# Altium schematic sheet cSLIM-SA.SchDoc: cSLIM v1 - Overview
size A4; Date: 11.01.2022; Author: Vetle Berg Abrahamsen; DrawnBy: Vetle Berg Abrahamsen; Revision: v1; SheetNumber: 1; SheetTotal: 12; PathAndName: C:\User\..\cSLIM-SA.SchDoc; Size: A4
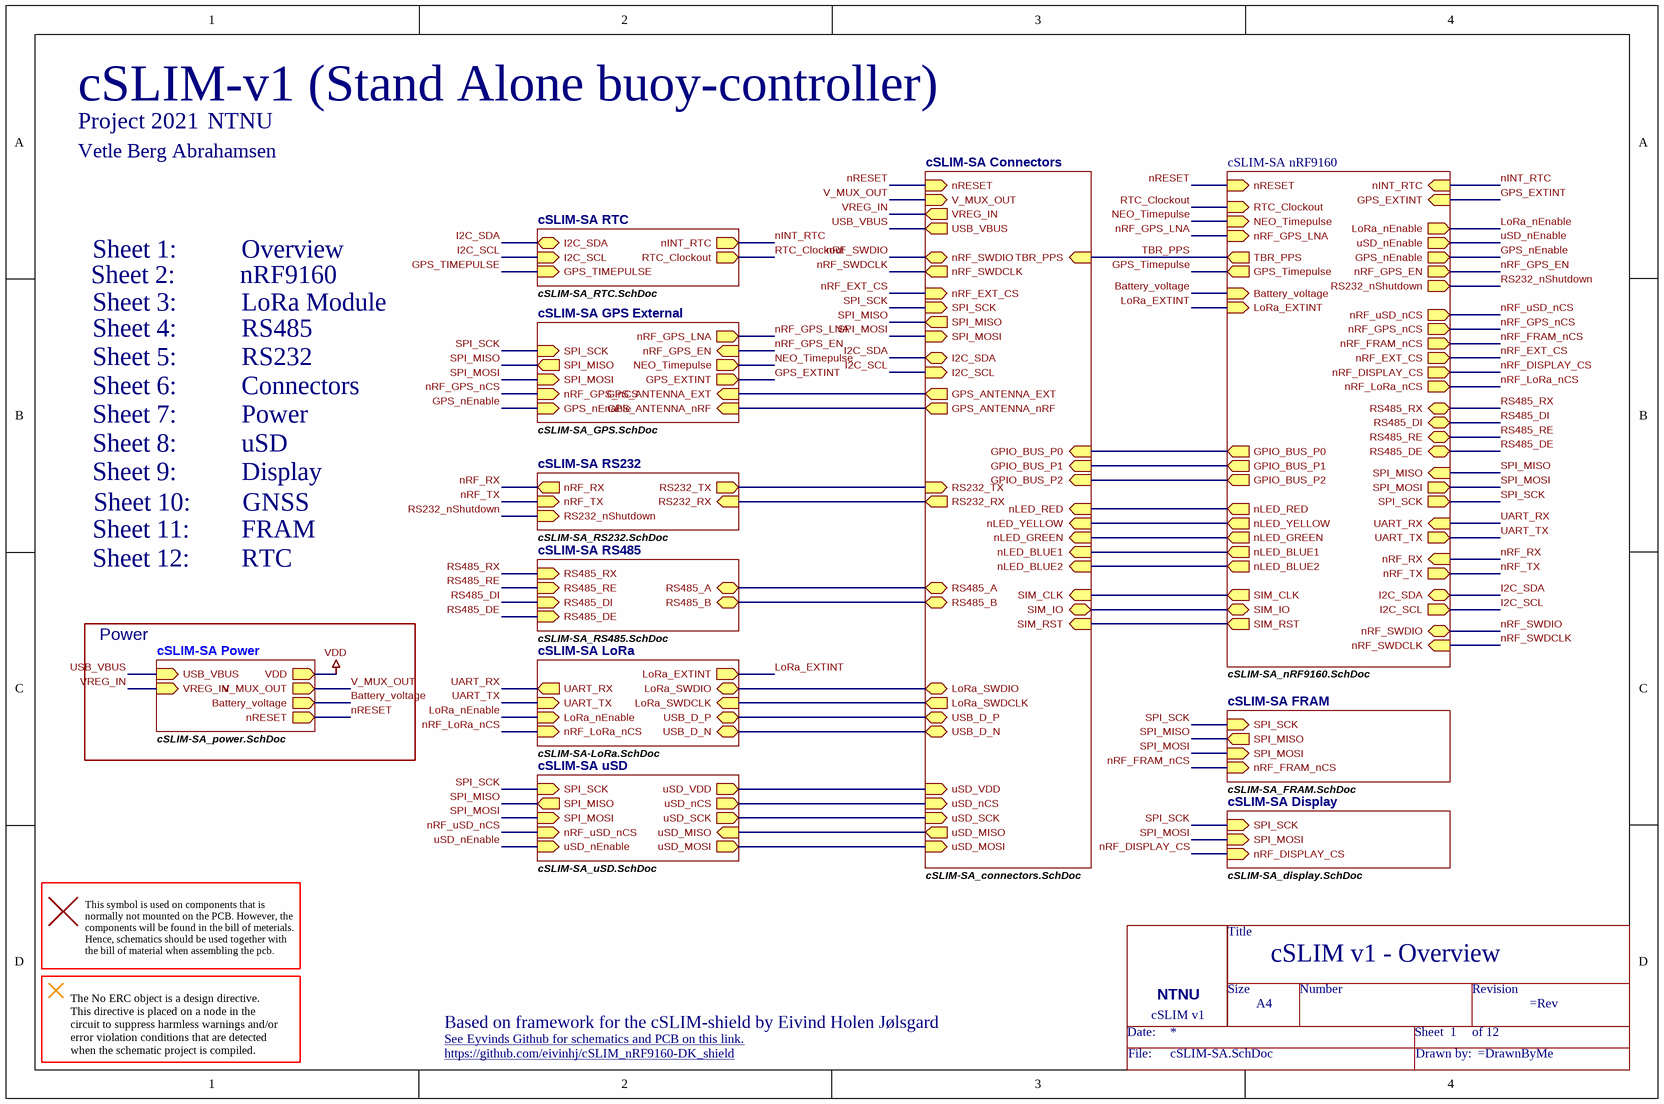
[diagram p0: cSLIM-SA.SchDoc]

## Parts
=DocumentName  Title_block  (value not drawn)  (no BOM)

## Sub-sheets
cSLIM-SA Connectors = cSLIM-SA_connectors.SchDoc: RS485_A (bidir), RS485_B (bidir), TBR_PPS (in), V_MUX_OUT (in), RS232_TX (in), RS232_RX (out), LoRa_SWDIO (bidir), LoRa_SWDCLK (out), nRESET (in), USB_D_N (bidir), USB_D_P (bidir), USB_VBUS (out), uSD_nCS (in), uSD_MOSI (in), uSD_SCK (in), uSD_MISO (out), uSD_VDD (in), nRF_EXT_CS (in), SPI_SCK (in), SPI_MOSI (in), SPI_MISO (out), I2C_SCL (in), I2C_SDA (bidir), nLED_RED (in), nLED_YELLOW (in), nLED_GREEN (in), nLED_BLUE1 (in), GPS_ANTENNA_EXT (out), nLED_BLUE2 (in), nRF_SWDIO (bidir), nRF_SWDCLK (out), SIM_CLK (in), SIM_RST (in), SIM_IO (bidir), GPS_ANTENNA_nRF (out), VREG_IN (out), GPIO_BUS_P0 (in), GPIO_BUS_P1 (in), GPIO_BUS_P2 (in)
cSLIM-SA Display = cSLIM-SA_display.SchDoc: SPI_SCK (in), SPI_MOSI (in), nRF_DISPLAY_CS (in)
cSLIM-SA FRAM = cSLIM-SA_FRAM.SchDoc: SPI_MISO (out), nRF_FRAM_nCS (in), SPI_SCK (in), SPI_MOSI (in)
cSLIM-SA GPS External = cSLIM-SA_GPS.SchDoc: nRF_GPS_nCS (in), GPS_nEnable (in), SPI_MISO (out), SPI_MOSI (in), SPI_SCK (in), NEO_Timepulse (out), GPS_EXTINT (out), GPS_ANTENNA_EXT (in), nRF_GPS_EN (in), GPS_ANTENNA_nRF (in), nRF_GPS_LNA (out)
cSLIM-SA LoRa = cSLIM-SA-LoRa.SchDoc: UART_RX (out), UART_TX (in), USB_D_P (bidir), USB_D_N (bidir), LoRa_SWDIO (bidir), LoRa_SWDCLK (in), LoRa_nEnable (in), LoRa_EXTINT (out), nRF_LoRa_nCS (in)
cSLIM-SA nRF9160 = cSLIM-SA_nRF9160.SchDoc: nRESET (in), RS485_RX (bidir), RS485_DI (bidir), nLED_RED (out), nINT_RTC (in), nLED_GREEN (out), LoRa_nEnable (out), uSD_nEnable (out), nRF_uSD_nCS (out), UART_RX (in), UART_TX (out), nRF_GPS_nCS (out), RS232_nShutdown (out), GPS_nEnable (out), Battery_voltage (in), nRF_EXT_CS (out), I2C_SDA (bidir), I2C_SCL (out), RS485_RE (bidir), RS485_DE (bidir), TBR_PPS (out), SPI_MISO (in), SPI_MOSI (out), SPI_SCK (out), LoRa_EXTINT (in), nRF_RX (in), nRF_TX (out), nRF_FRAM_nCS (out), RTC_Clockout (in), GPS_Timepulse (out), nRF_SWDIO (bidir), nRF_SWDCLK (in), SIM_CLK (out), SIM_IO (bidir), SIM_RST (out), nRF_DISPLAY_CS (out), nLED_YELLOW (out), nLED_BLUE1 (out), nLED_BLUE2 (out), GPS_EXTINT (in), nRF_GPS_EN (out), nRF_GPS_LNA (in), NEO_Timepulse (in), GPIO_BUS_P0 (out), GPIO_BUS_P2 (out), GPIO_BUS_P1 (out), nRF_LoRa_nCS (out)
cSLIM-SA Power = cSLIM-SA_power.SchDoc: nRESET (out), VDD (out), USB_VBUS (in), V_MUX_OUT (out), Battery_voltage (out), VREG_IN (in)
cSLIM-SA RS232 = cSLIM-SA_RS232.SchDoc: RS232_nShutdown (in), RS232_TX (out), RS232_RX (in), nRF_TX (in), nRF_RX (out)
cSLIM-SA RS485 = cSLIM-SA_RS485.SchDoc: RS485_RX (in), RS485_RE (in), RS485_DE (in), RS485_DI (in), RS485_B (bidir), RS485_A (bidir)
cSLIM-SA RTC = cSLIM-SA_RTC.SchDoc: I2C_SCL (in), I2C_SDA (bidir), nINT_RTC (out), RTC_Clockout (out), GPS_TIMEPULSE (in)
cSLIM-SA uSD = cSLIM-SA_uSD.SchDoc: uSD_VDD (out), uSD_MISO (in), uSD_MOSI (out), uSD_SCK (out), uSD_nCS (out), nRF_uSD_nCS (in), uSD_nEnable (in), SPI_MISO (out), SPI_MOSI (in), SPI_SCK (in)

## Nets
VDD: sheet cSLIM-SA Power/VDD
Battery_voltage: sheet cSLIM-SA Power/Battery_voltage, sheet cSLIM-SA nRF9160/Battery_voltage
GPS_EXTINT: sheet cSLIM-SA GPS External/GPS_EXTINT, sheet cSLIM-SA nRF9160/GPS_EXTINT
GPS_nEnable: sheet cSLIM-SA GPS External/GPS_nEnable, sheet cSLIM-SA nRF9160/GPS_nEnable
GPS_TIMEPULSE: sheet cSLIM-SA RTC/GPS_TIMEPULSE, sheet cSLIM-SA nRF9160/GPS_Timepulse
I2C_SCL: sheet cSLIM-SA Connectors/I2C_SCL, sheet cSLIM-SA RTC/I2C_SCL, sheet cSLIM-SA nRF9160/I2C_SCL
I2C_SDA: sheet cSLIM-SA Connectors/I2C_SDA, sheet cSLIM-SA RTC/I2C_SDA, sheet cSLIM-SA nRF9160/I2C_SDA
LoRa_EXTINT: sheet cSLIM-SA LoRa/LoRa_EXTINT, sheet cSLIM-SA nRF9160/LoRa_EXTINT
LoRa_nEnable: sheet cSLIM-SA LoRa/LoRa_nEnable, sheet cSLIM-SA nRF9160/LoRa_nEnable
NEO_Timepulse: sheet cSLIM-SA GPS External/NEO_Timepulse, sheet cSLIM-SA nRF9160/NEO_Timepulse
nINT_RTC: sheet cSLIM-SA RTC/nINT_RTC, sheet cSLIM-SA nRF9160/nINT_RTC
nRESET: sheet cSLIM-SA Connectors/nRESET, sheet cSLIM-SA Power/nRESET, sheet cSLIM-SA nRF9160/nRESET
nRF_DISPLAY_CS: sheet cSLIM-SA Display/nRF_DISPLAY_CS, sheet cSLIM-SA nRF9160/nRF_DISPLAY_CS
nRF_EXT_CS: sheet cSLIM-SA Connectors/nRF_EXT_CS, sheet cSLIM-SA nRF9160/nRF_EXT_CS
nRF_FRAM_nCS: sheet cSLIM-SA FRAM/nRF_FRAM_nCS, sheet cSLIM-SA nRF9160/nRF_FRAM_nCS
nRF_GPS_EN: sheet cSLIM-SA GPS External/nRF_GPS_EN, sheet cSLIM-SA nRF9160/nRF_GPS_EN
nRF_GPS_LNA: sheet cSLIM-SA GPS External/nRF_GPS_LNA, sheet cSLIM-SA nRF9160/nRF_GPS_LNA
nRF_GPS_nCS: sheet cSLIM-SA GPS External/nRF_GPS_nCS, sheet cSLIM-SA nRF9160/nRF_GPS_nCS
nRF_LoRa_nCS: sheet cSLIM-SA LoRa/nRF_LoRa_nCS, sheet cSLIM-SA nRF9160/nRF_LoRa_nCS
nRF_RX: sheet cSLIM-SA RS232/nRF_RX, sheet cSLIM-SA nRF9160/nRF_RX
nRF_SWDCLK: sheet cSLIM-SA Connectors/nRF_SWDCLK, sheet cSLIM-SA nRF9160/nRF_SWDCLK
nRF_SWDIO: sheet cSLIM-SA Connectors/nRF_SWDIO, sheet cSLIM-SA nRF9160/nRF_SWDIO
nRF_TX: sheet cSLIM-SA RS232/nRF_TX, sheet cSLIM-SA nRF9160/nRF_TX
nRF_uSD_nCS: sheet cSLIM-SA uSD/nRF_uSD_nCS, sheet cSLIM-SA nRF9160/nRF_uSD_nCS
RS232_nShutdown: sheet cSLIM-SA RS232/RS232_nShutdown, sheet cSLIM-SA nRF9160/RS232_nShutdown
RS485_DE: sheet cSLIM-SA RS485/RS485_DE, sheet cSLIM-SA nRF9160/RS485_DE
RS485_DI: sheet cSLIM-SA RS485/RS485_DI, sheet cSLIM-SA nRF9160/RS485_DI
RS485_RE: sheet cSLIM-SA RS485/RS485_RE, sheet cSLIM-SA nRF9160/RS485_RE
RS485_RX: sheet cSLIM-SA RS485/RS485_RX, sheet cSLIM-SA nRF9160/RS485_RX
RTC_Clockout: sheet cSLIM-SA RTC/RTC_Clockout, sheet cSLIM-SA nRF9160/RTC_Clockout
SPI_MISO: sheet cSLIM-SA Connectors/SPI_MISO, sheet cSLIM-SA uSD/SPI_MISO, sheet cSLIM-SA GPS External/SPI_MISO, sheet cSLIM-SA FRAM/SPI_MISO, sheet cSLIM-SA nRF9160/SPI_MISO
SPI_MOSI: sheet cSLIM-SA Connectors/SPI_MOSI, sheet cSLIM-SA uSD/SPI_MOSI, sheet cSLIM-SA Display/SPI_MOSI, sheet cSLIM-SA GPS External/SPI_MOSI, sheet cSLIM-SA FRAM/SPI_MOSI, sheet cSLIM-SA nRF9160/SPI_MOSI
SPI_SCK: sheet cSLIM-SA Connectors/SPI_SCK, sheet cSLIM-SA uSD/SPI_SCK, sheet cSLIM-SA Display/SPI_SCK, sheet cSLIM-SA GPS External/SPI_SCK, sheet cSLIM-SA FRAM/SPI_SCK, sheet cSLIM-SA nRF9160/SPI_SCK
TBR_PPS: sheet cSLIM-SA Connectors/TBR_PPS, sheet cSLIM-SA nRF9160/TBR_PPS
UART_RX: sheet cSLIM-SA LoRa/UART_RX, sheet cSLIM-SA nRF9160/UART_RX
UART_TX: sheet cSLIM-SA LoRa/UART_TX, sheet cSLIM-SA nRF9160/UART_TX
USB_VBUS: sheet cSLIM-SA Connectors/USB_VBUS, sheet cSLIM-SA Power/USB_VBUS
uSD_nEnable: sheet cSLIM-SA uSD/uSD_nEnable, sheet cSLIM-SA nRF9160/uSD_nEnable
V_MUX_OUT: sheet cSLIM-SA Connectors/V_MUX_OUT, sheet cSLIM-SA Power/V_MUX_OUT
VREG_IN: sheet cSLIM-SA Connectors/VREG_IN, sheet cSLIM-SA Power/VREG_IN
(unnamed): sheet cSLIM-SA LoRa/USB_D_P, sheet cSLIM-SA Connectors/USB_D_P
(unnamed): sheet cSLIM-SA LoRa/USB_D_N, sheet cSLIM-SA Connectors/USB_D_N
(unnamed): sheet cSLIM-SA LoRa/LoRa_SWDIO, sheet cSLIM-SA Connectors/LoRa_SWDIO
(unnamed): sheet cSLIM-SA LoRa/LoRa_SWDCLK, sheet cSLIM-SA Connectors/LoRa_SWDCLK
(unnamed): sheet cSLIM-SA RS485/RS485_B, sheet cSLIM-SA Connectors/RS485_B
(unnamed): sheet cSLIM-SA RS485/RS485_A, sheet cSLIM-SA Connectors/RS485_A
(unnamed): sheet cSLIM-SA RS232/RS232_TX, sheet cSLIM-SA Connectors/RS232_TX
(unnamed): sheet cSLIM-SA RS232/RS232_RX, sheet cSLIM-SA Connectors/RS232_RX
(unnamed): sheet cSLIM-SA Connectors/uSD_nCS, sheet cSLIM-SA uSD/uSD_nCS
(unnamed): sheet cSLIM-SA Connectors/uSD_MOSI, sheet cSLIM-SA uSD/uSD_MOSI
(unnamed): sheet cSLIM-SA Connectors/uSD_SCK, sheet cSLIM-SA uSD/uSD_SCK
(unnamed): sheet cSLIM-SA Connectors/uSD_MISO, sheet cSLIM-SA uSD/uSD_MISO
(unnamed): sheet cSLIM-SA Connectors/uSD_VDD, sheet cSLIM-SA uSD/uSD_VDD
(unnamed): sheet cSLIM-SA Connectors/nLED_RED, sheet cSLIM-SA nRF9160/nLED_RED
(unnamed): sheet cSLIM-SA Connectors/nLED_YELLOW, sheet cSLIM-SA nRF9160/nLED_YELLOW
(unnamed): sheet cSLIM-SA Connectors/nLED_GREEN, sheet cSLIM-SA nRF9160/nLED_GREEN
(unnamed): sheet cSLIM-SA Connectors/nLED_BLUE1, sheet cSLIM-SA nRF9160/nLED_BLUE1
(unnamed): sheet cSLIM-SA Connectors/GPS_ANTENNA_EXT, sheet cSLIM-SA GPS External/GPS_ANTENNA_EXT
(unnamed): sheet cSLIM-SA Connectors/nLED_BLUE2, sheet cSLIM-SA nRF9160/nLED_BLUE2
(unnamed): sheet cSLIM-SA Connectors/SIM_CLK, sheet cSLIM-SA nRF9160/SIM_CLK
(unnamed): sheet cSLIM-SA Connectors/SIM_RST, sheet cSLIM-SA nRF9160/SIM_RST
(unnamed): sheet cSLIM-SA Connectors/SIM_IO, sheet cSLIM-SA nRF9160/SIM_IO
(unnamed): sheet cSLIM-SA Connectors/GPS_ANTENNA_nRF, sheet cSLIM-SA GPS External/GPS_ANTENNA_nRF
(unnamed): sheet cSLIM-SA Connectors/GPIO_BUS_P0, sheet cSLIM-SA nRF9160/GPIO_BUS_P0
(unnamed): sheet cSLIM-SA Connectors/GPIO_BUS_P1, sheet cSLIM-SA nRF9160/GPIO_BUS_P1
(unnamed): sheet cSLIM-SA Connectors/GPIO_BUS_P2, sheet cSLIM-SA nRF9160/GPIO_BUS_P2

## Notes on the sheet
- cSLIM-v1 (Stand Alone buoy-controller)
- Project 2021
- Vetle Berg Abrahamsen
- NTNU
- Sheet 1:          Overview
- Sheet 2:          nRF9160
- Sheet 3:          LoRa Module
- Sheet 5:          RS232
- Sheet 6:          Connectors
- Sheet 4:          RS485
- Sheet 7:          Power
- Sheet 8:          uSD
- Sheet 9:          Display
- Sheet 11:        FRAM
- Sheet 10:        GNSS
- Sheet 12:        RTC
- Power
- This symbol is used on components that is normally not mounted on the PCB. However, the components will be found in the bill of meterials. Hence, schematics should be used together with the bill of material when assembling the pcb.
- The No ERC object is a design directive.
  This directive is placed on a node in the circuit to suppress harmless warnings and/or error violation conditions that are detected when the schematic project is compiled.
- Based on framework for the cSLIM-shield by Eivind Holen Jølsgard
- See Eyvinds Github for schematics and PCB on this link. <https://github.com/eivinhj/cSLIM_nRF9160-DK_shield>
- https://github.com/eivinhj/cSLIM_nRF9160-DK_shield
- 1
- 2
- 3
- 4
- 5
- 6
- A
- B
- C
- Eivind Jølsgard
- D
- Title: cSLIM Overview
- File: cSLIM-shield.sch
- Sheet: /
- KiCad E.D.A.  kicad (5.1.4)-1
- Size: A4
- Date: 2021-03-31
- Rev: v1
- Id: 1/11
- (in symbol Title_block) Title; Size; Number; Revision; NTNU; cSLIM v1; Date:; Sheet; of; File:; Drawn by: